# EAGLE schematic wordle_display (EAGLE 9.3.2)
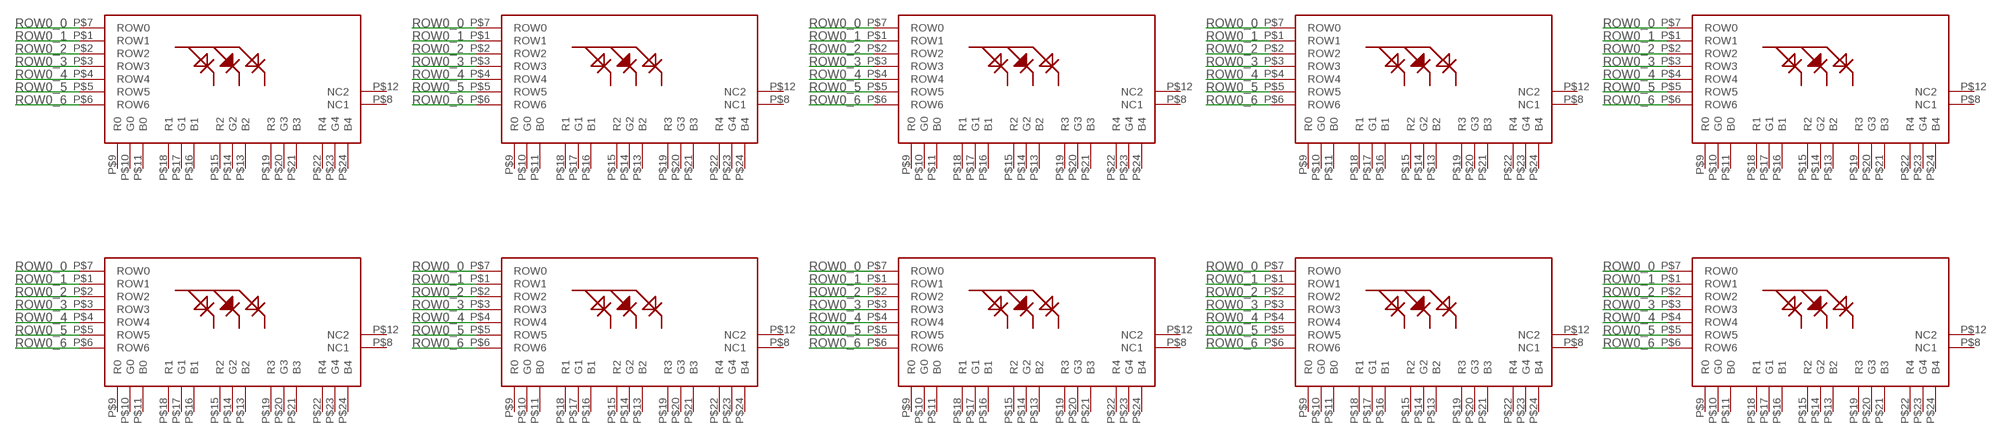
[diagram p0: schematic, sheet 1]

## Parts
U$1  AE-UDOTMATRIX5X7-RGB  [AE-UDOTMATRIX5X7-RGB]
U$2  AE-UDOTMATRIX5X7-RGB  [AE-UDOTMATRIX5X7-RGB]
U$3  AE-UDOTMATRIX5X7-RGB  [AE-UDOTMATRIX5X7-RGB]
U$4  AE-UDOTMATRIX5X7-RGB  [AE-UDOTMATRIX5X7-RGB]
U$5  AE-UDOTMATRIX5X7-RGB  [AE-UDOTMATRIX5X7-RGB]
U$6  AE-UDOTMATRIX5X7-RGB  [AE-UDOTMATRIX5X7-RGB]
U$7  AE-UDOTMATRIX5X7-RGB  [AE-UDOTMATRIX5X7-RGB]
U$8  AE-UDOTMATRIX5X7-RGB  [AE-UDOTMATRIX5X7-RGB]
U$9  AE-UDOTMATRIX5X7-RGB  [AE-UDOTMATRIX5X7-RGB]
U$10  AE-UDOTMATRIX5X7-RGB  [AE-UDOTMATRIX5X7-RGB]

## Nets
ROW0_0: U$1.P$7(ROW0) U$2.P$7(ROW0) U$3.P$7(ROW0) U$4.P$7(ROW0) U$5.P$7(ROW0) U$6.P$7(ROW0) U$7.P$7(ROW0) U$8.P$7(ROW0) U$9.P$7(ROW0) U$10.P$7(ROW0)
ROW0_1: U$1.P$1(ROW1) U$2.P$1(ROW1) U$3.P$1(ROW1) U$4.P$1(ROW1) U$5.P$1(ROW1) U$6.P$1(ROW1) U$7.P$1(ROW1) U$8.P$1(ROW1) U$9.P$1(ROW1) U$10.P$1(ROW1)
ROW0_2: U$1.P$2(ROW2) U$2.P$2(ROW2) U$3.P$2(ROW2) U$4.P$2(ROW2) U$5.P$2(ROW2) U$6.P$2(ROW2) U$7.P$2(ROW2) U$8.P$2(ROW2) U$9.P$2(ROW2) U$10.P$2(ROW2)
ROW0_3: U$1.P$3(ROW3) U$2.P$3(ROW3) U$3.P$3(ROW3) U$4.P$3(ROW3) U$5.P$3(ROW3) U$6.P$3(ROW3) U$7.P$3(ROW3) U$8.P$3(ROW3) U$9.P$3(ROW3) U$10.P$3(ROW3)
ROW0_4: U$1.P$4(ROW4) U$2.P$4(ROW4) U$3.P$4(ROW4) U$4.P$4(ROW4) U$5.P$4(ROW4) U$6.P$4(ROW4) U$7.P$4(ROW4) U$8.P$4(ROW4) U$9.P$4(ROW4) U$10.P$4(ROW4)
ROW0_5: U$1.P$5(ROW5) U$2.P$5(ROW5) U$3.P$5(ROW5) U$4.P$5(ROW5) U$5.P$5(ROW5) U$6.P$5(ROW5) U$7.P$5(ROW5) U$8.P$5(ROW5) U$9.P$5(ROW5) U$10.P$5(ROW5)
ROW0_6: U$1.P$6(ROW6) U$2.P$6(ROW6) U$3.P$6(ROW6) U$4.P$6(ROW6) U$5.P$6(ROW6) U$6.P$6(ROW6) U$7.P$6(ROW6) U$8.P$6(ROW6) U$9.P$6(ROW6) U$10.P$6(ROW6)
Unconnected: U$1.P$8(NC1) U$1.P$9(R0) U$1.P$10(G0) U$1.P$11(B0) U$1.P$12(NC2) U$1.P$13(B2) U$1.P$14(G2) U$1.P$15(R2) U$1.P$16(B1) U$1.P$17(G1) U$1.P$18(R1) U$1.P$19(R3) U$1.P$20(G3) U$1.P$21(B3) U$1.P$22(R4) U$1.P$23(G4) U$1.P$24(B4) U$2.P$8(NC1) U$2.P$9(R0) U$2.P$10(G0) U$2.P$11(B0) U$2.P$12(NC2) U$2.P$13(B2) U$2.P$14(G2) U$2.P$15(R2) U$2.P$16(B1) U$2.P$17(G1) U$2.P$18(R1) U$2.P$19(R3) U$2.P$20(G3) U$2.P$21(B3) U$2.P$22(R4) U$2.P$23(G4) U$2.P$24(B4) U$3.P$8(NC1) U$3.P$9(R0) U$3.P$10(G0) U$3.P$11(B0) U$3.P$12(NC2) U$3.P$13(B2) U$3.P$14(G2) U$3.P$15(R2) U$3.P$16(B1) U$3.P$17(G1) U$3.P$18(R1) U$3.P$19(R3) U$3.P$20(G3) U$3.P$21(B3) U$3.P$22(R4) U$3.P$23(G4) U$3.P$24(B4) U$4.P$8(NC1) U$4.P$9(R0) U$4.P$10(G0) U$4.P$11(B0) U$4.P$12(NC2) U$4.P$13(B2) U$4.P$14(G2) U$4.P$15(R2) U$4.P$16(B1) U$4.P$17(G1) U$4.P$18(R1) U$4.P$19(R3) U$4.P$20(G3) U$4.P$21(B3) U$4.P$22(R4) U$4.P$23(G4) U$4.P$24(B4) U$5.P$8(NC1) U$5.P$9(R0) U$5.P$10(G0) U$5.P$11(B0) U$5.P$12(NC2) U$5.P$13(B2) U$5.P$14(G2) U$5.P$15(R2) U$5.P$16(B1) U$5.P$17(G1) U$5.P$18(R1) U$5.P$19(R3) U$5.P$20(G3) U$5.P$21(B3) U$5.P$22(R4) U$5.P$23(G4) U$5.P$24(B4) U$6.P$8(NC1) U$6.P$9(R0) U$6.P$10(G0) U$6.P$11(B0) U$6.P$12(NC2) U$6.P$13(B2) U$6.P$14(G2) U$6.P$15(R2) U$6.P$16(B1) U$6.P$17(G1) U$6.P$18(R1) U$6.P$19(R3) U$6.P$20(G3) U$6.P$21(B3) U$6.P$22(R4) U$6.P$23(G4) U$6.P$24(B4) U$7.P$8(NC1) U$7.P$9(R0) U$7.P$10(G0) U$7.P$11(B0) U$7.P$12(NC2) U$7.P$13(B2) U$7.P$14(G2) U$7.P$15(R2) U$7.P$16(B1) U$7.P$17(G1) U$7.P$18(R1) U$7.P$19(R3) U$7.P$20(G3) U$7.P$21(B3) U$7.P$22(R4) U$7.P$23(G4) U$7.P$24(B4) U$8.P$8(NC1) U$8.P$9(R0) U$8.P$10(G0) U$8.P$11(B0) U$8.P$12(NC2) U$8.P$13(B2) U$8.P$14(G2) U$8.P$15(R2) U$8.P$16(B1) U$8.P$17(G1) U$8.P$18(R1) U$8.P$19(R3) U$8.P$20(G3) U$8.P$21(B3) U$8.P$22(R4) U$8.P$23(G4) U$8.P$24(B4) U$9.P$8(NC1) U$9.P$9(R0) U$9.P$10(G0) U$9.P$11(B0) U$9.P$12(NC2) U$9.P$13(B2) U$9.P$14(G2) U$9.P$15(R2) U$9.P$16(B1) U$9.P$17(G1) U$9.P$18(R1) U$9.P$19(R3) U$9.P$20(G3) U$9.P$21(B3) U$9.P$22(R4) U$9.P$23(G4) U$9.P$24(B4) U$10.P$8(NC1) U$10.P$9(R0) U$10.P$10(G0) U$10.P$11(B0) U$10.P$12(NC2) U$10.P$13(B2) U$10.P$14(G2) U$10.P$15(R2) U$10.P$16(B1) U$10.P$17(G1) U$10.P$18(R1) U$10.P$19(R3) U$10.P$20(G3) U$10.P$21(B3) U$10.P$22(R4) U$10.P$23(G4) U$10.P$24(B4)

## Library data of the parts
U$1-U$10 = 19kihara:AE-UDOTMATRIX5X7-RGB